# Altium schematic sheet ATMEGA328P.SchDoc
size A; SheetNumber: 1; SheetTotal: 2
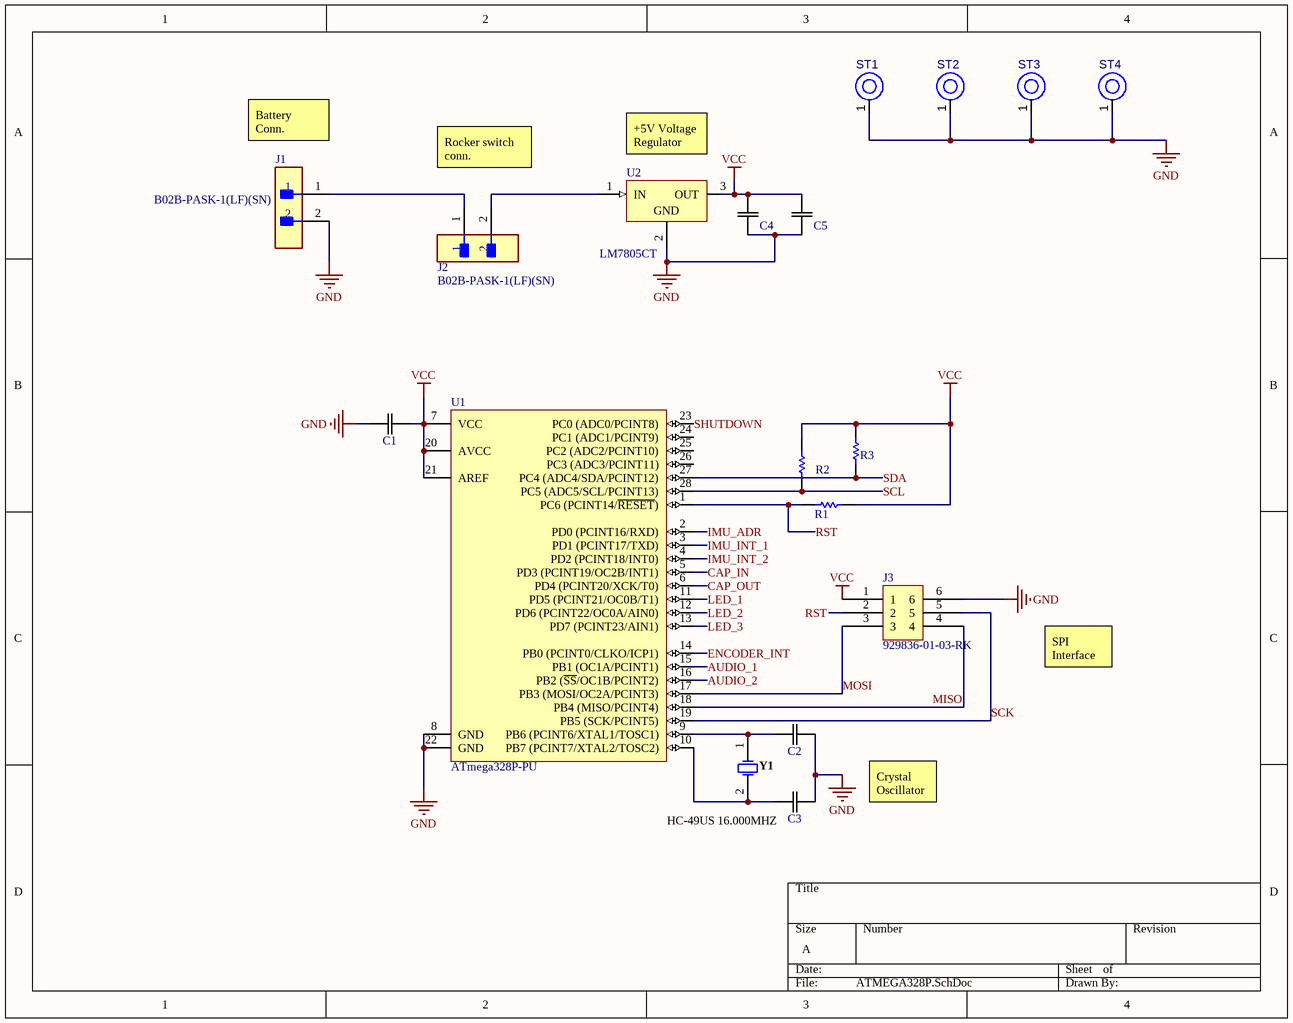
[diagram p0: ATMEGA328P.SchDoc]

## Parts
C1  Cap, 22pF, ceramic, TH  [New footprint 1]  (value not drawn)
C2  Cap, 22pF, ceramic, TH  [New footprint 1]  (value not drawn)
C3  Cap, 22pF, ceramic, TH  [New footprint 1]  (value not drawn)
C4  Cap, 22pF, ceramic, TH  [New footprint 1]  (value not drawn)
C5  Cap, 22pF, ceramic, TH  [New footprint 1]  (value not drawn)
J1  B02B-PASK-1(LF)(SN)  [FP-B02B-PASK-1_LF_SN-MFG]
J2  B02B-PASK-1(LF)(SN)  [FP-B02B-PASK-1_LF_SN-MFG]
J3  929836-01-03-RK  [929836-01-03-RK-Footprint-1]
R1  1k Through-Hole 1/4W  [RESA60-630X240]  (value not drawn)
R2  1k Through-Hole 1/4W  [RESA60-630X240]  (value not drawn)
R3  1k Through-Hole 1/4W  [RESA60-630X240]  (value not drawn)
ST1  PTH-M2D5X5  [PTH-M2D5X5]  (value not drawn)
ST2  PTH-M2D5X5  [PTH-M2D5X5]  (value not drawn)
ST3  PTH-M2D5X5  [PTH-M2D5X5]  (value not drawn)
ST4  PTH-M2D5X5  [PTH-M2D5X5]  (value not drawn)
U1  ATmega328P-PU  [28P3]
U2  LM7805CT  [FAIR-TO-220-3]
Y1  HC-49US 16.000MHZ  [JPY-HC-49US]

## Nets
GND: C1.1 C2.2 C3.2 C4.2 C5.2 J1.2 J3.6 ST1.1(H1) ST2.1(H1) ST3.1(H1) ST4.1(H1) U1.8(GND) U1.22(GND) U2.2(GND)
VCC: C1.2 C4.1 C5.1 J3.1 R1.2 R2.2 R3.2 U1.7(VCC) U1.20(AVCC) U1.21(AREF) U2.3(OUT)
AUDIO_1: U1.15(PB1_(OC1A/PCINT1))
AUDIO_2: U1.16(PB2_(~{SS}/OC1B/PCINT2))
CAP_IN: U1.5(PD3_(PCINT19/OC2B/INT1))
CAP_OUT: U1.6(PD4_(PCINT20/XCK/T0))
ENCODER_INT: U1.14(PB0_(PCINT0/CLKO/ICP1))
IMU_ADR: U1.2(PD0_(PCINT16/RXD))
IMU_INT_1: U1.3(PD1_(PCINT17/TXD))
IMU_INT_2: U1.4(PD2_(PCINT18/INT0))
LED_1: U1.11(PD5_(PCINT21/OC0B/T1))
LED_2: U1.12(PD6_(PCINT22/OC0A/AIN0))
LED_3: U1.13(PD7_(PCINT23/AIN1))
MISO: J3.4 U1.18(PB4_(MISO/PCINT4))
MOSI: J3.3 U1.17(PB3_(MOSI/OC2A/PCINT3))
RST: J3.2 R1.1 U1.1(PC6_(PCINT14/~{RESET}))
SCK: J3.5 U1.19(PB5_(SCK/PCINT5))
SCL: R2.1 U1.28(PC5_(ADC5/SCL/PCINT13))
SDA: R3.1 U1.27(PC4_(ADC4/SDA/PCINT12))
SHUTDOWN: U1.23(PC0_(ADC0/PCINT8))
NetC2_1: C2.1 U1.9(PB6_(PCINT6/XTAL1/TOSC1)) Y1.1
NetC3_1: C3.1 U1.10(PB7_(PCINT7/XTAL2/TOSC2)) Y1.2
NetJ1_1: J1.1 J2.1
NetJ2_2: J2.2 U2.1(IN)

Not connected (* = marked no-connect by the designer): U1 24(PC1_(ADC1/PCINT9)) 25(PC2_(ADC2/PCINT10)) 26(PC3_(ADC3/PCINT11))

## Notes on the sheet
- Battery Conn.
- Rocker switch conn.
- (near U2) +5V Voltage Regulator
- SPI Interface
- Crystal Oscillator

## Library data of the parts
C1-C5 = CMP-001-00113-1
J1 J2 = CMP-17439-000415-1: CONN HEADER VERT 2POS 2MM; Number of Contacts: 2; Current Rating: 3A; Insulation Resistance: 1GR; Mated Stacking Heights: 14.9mm; Voltage Rating: 250V; Gender: Male; Pitch: 2mm; Orientation: Straight; Contact Finish - Mating: TIN; Mount: Through Hole; Contact Type: Male Pin; Number of Rows: 1; Fastening Type: Ramp; Series: PA; Connector Type: Header; Insulation Color: Natural; Flammability Rating: UL94 V-0; Material: Polybutylene; Contact Shape: Square; Contact Plating: Tin; Insulation Material: PBT; Max Operating Temperature: 85°C; Housing Color: White; Number of Positions: 2; Contact Material: Copper Alloy; Min Operating Temperature: -25°C; Lead Free: Lead Free; Contact Mating Length: 0.126inch; Termination: Solder; Packaging: Bulk; Color: Natural
J3 = CMP-002-00092-3: 3x2 male header
R1-R3 = CMP-009-00195-1: RES 1K OHM 1/4W 1% AXIAL; Resistance: 1kR; Voltage Rating (DC): 200V; Temperature Coefficient: 100ppm/°C; Lead Diameter: 0.6mm; Max Power Dissipation: 250mW; Voltage Rating: 250V; Min Operating Temperature: -55°C; Max Operating Temperature: 155°C; Case/Package: Axial; Series: MFR; Tolerance: 1%; Lead Free: Lead Free; Packaging: Bulk; Length: 0.248inch; Mount: Through Hole; Width: 6.3mm; Termination: Axial; RoHS Compliant: Yes; Package Quantity: 200; Number of Terminations: 2; Power Rating: 250mW; Resistor Type: Metal Film
ST1-ST4 = CMP-00028-00004-2: M2 PTH (2.5mm), 5mm pad; Pins: 1
U1 = CMP-0095-00013-2: 8-bit AVR Microcontroller, 32KB Flash, 1KB EEPROM, 2KB SRAM, 28-pin PDIP, Industrial Grade (-40°C to 85°C); RevisionNote: DatasheetVersion updated. URLs added.; PackageVersion: revB, Sep-2001; PackageDescription: 28-lead (0.300"/7.62mm Wide) Plastic Dual Inline Package (PDIP); DatasheetVersion: revD, May-2011; ComponentLink1Description: Manufacturer URL; ComponentLink1URL: http://www.atmel.com/; PackageReference: 28P3; ComponentLink2Description: ATmega48A/48PA/88A/88PA/168A/168PA/328/328P Datasheet; ComponentLink3URL: http://www.atmel.com/dyn/resources/prod_documents/8271S.pdf; ComponentLink2URL: http://www.atmel.com/dyn/resources/prod_documents/8271.pdf; ComponentLink3Description: ATmega48A/48PA/88A/88PA/168A/168PA/328/328P Summary
U2 = CMP-2000-04938-1: Positive Voltage Regulator, 5 V, 1 A, -40 to 125 degC, 3-Pin TO-220, RoHS, Tube; Manufacturer: FairchildSemiconductor; Maximum Input Voltage: 35V; Maximum Quiescent Current: 8mA; Load Regulation: 100mV; Maximum Output Current: 2.2(Typ)A; Output Type: Fixed; Typical Dropout Voltage @ Current: 2@1AV; Rad Hard: No; Output Voltage: 5V; Accuracy: ±4%; Number of Outputs: 1; Category: LinearRegulator; Package Description: 3-Pin Through Hole Device, Body 10 x 4.5 mm, Pitch 2.54 mm; Packaging: Rail/Tube; Mounting: ThroughHole; Polarity: Positive; Manufacturer URL: https://www.fairchildsemi.com/; Line Regulation: 100mV; Datasheet Version: Aug-12; Datasheet URL: https://datasheet.ciiva.com/26904/lm7805ct-26904988.pdf; Package Reference: TO-220; Package URL: https://www.fairchildsemi.com/package-drawings/TO/TO220B03.pdf; Package: 3TO-220AB; Operating Temperature: -40to125degC; Type: Linear
Y1 = CMP-003-00005-1: Crystal, 16 MHz, +/- 30 ppm, 18 pF, -20 to 70 degC, 2-Pin THD; Manufacturer: Jing peng yuan; Frequency: 16MHz; Package Description: 2-Pin Throug Hole Device, Body 11.05 x 4.65 mm, Pitch 4.9 mm; Package Reference: HC-49US; Datasheet Version: May-15; Case/Package: HC-49US; Mounting Technology: TH; Datasheet URL: https://statics3.seeedstudio.com/images/opl/datasheet/306010014.pdf; RoHS Compliant: Unknown